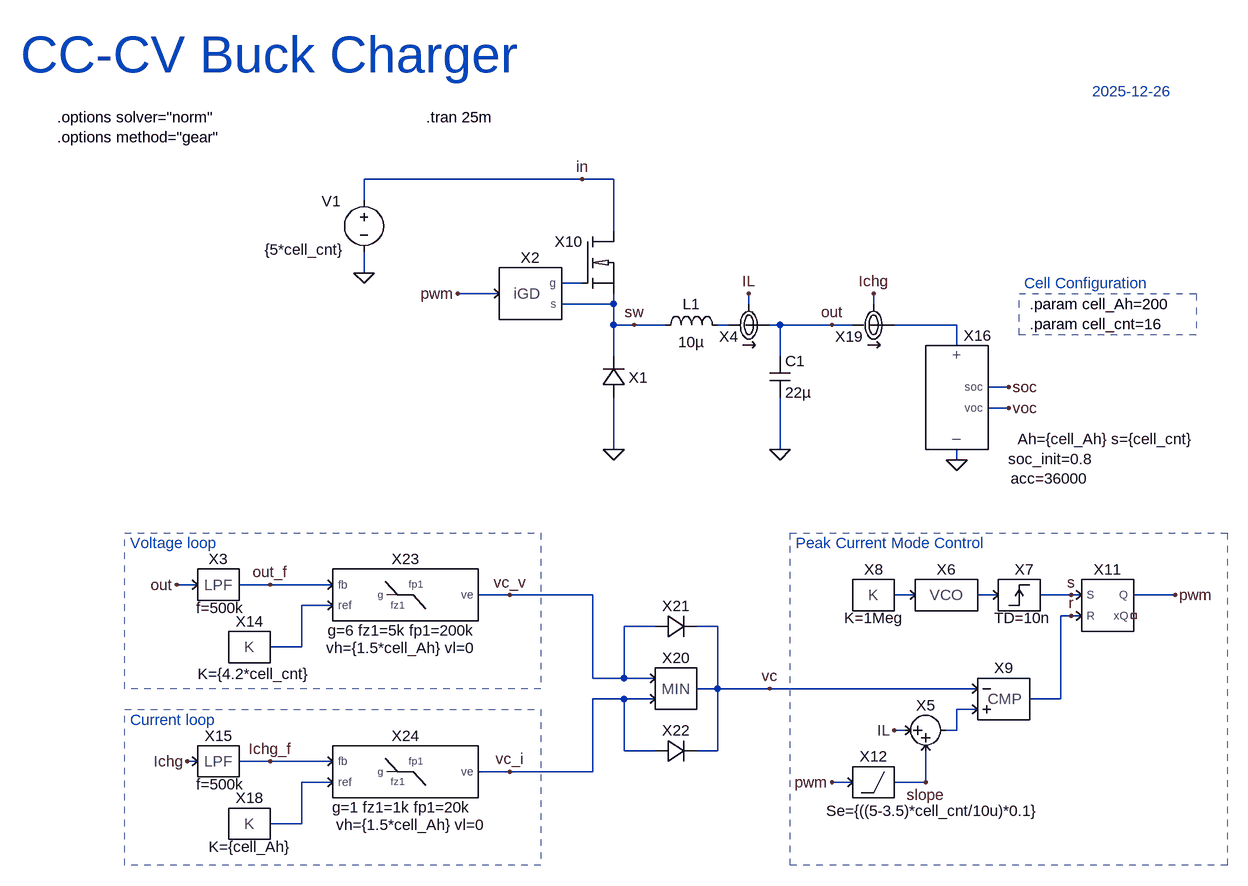
[diagram p0: schematic BUCK_CCCV.asc]
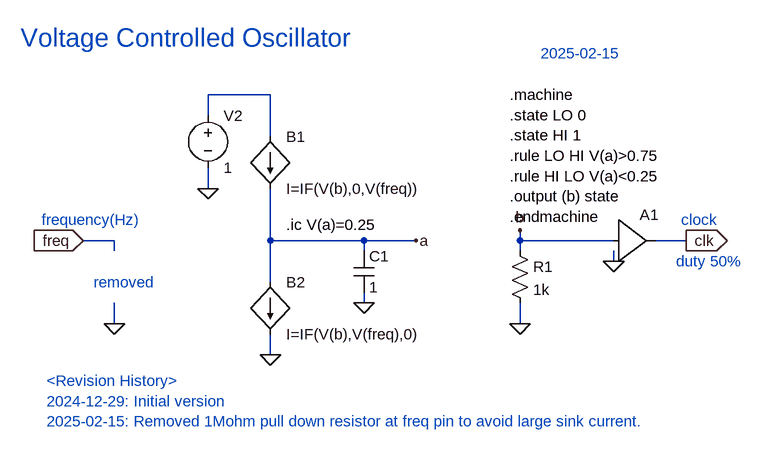
[diagram p1: sub-circuit vco.asc]
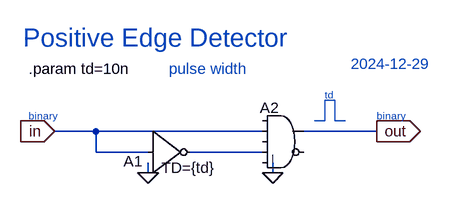
[diagram p2: sub-circuit posedge.asc]
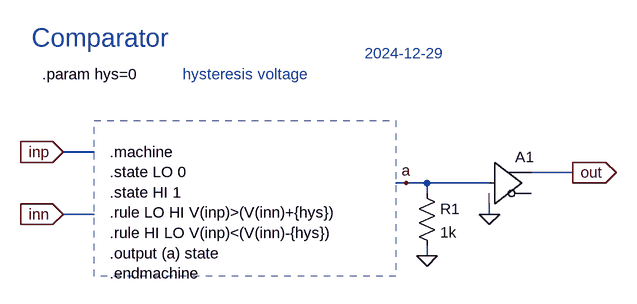
[diagram p3: sub-circuit cmp.asc]
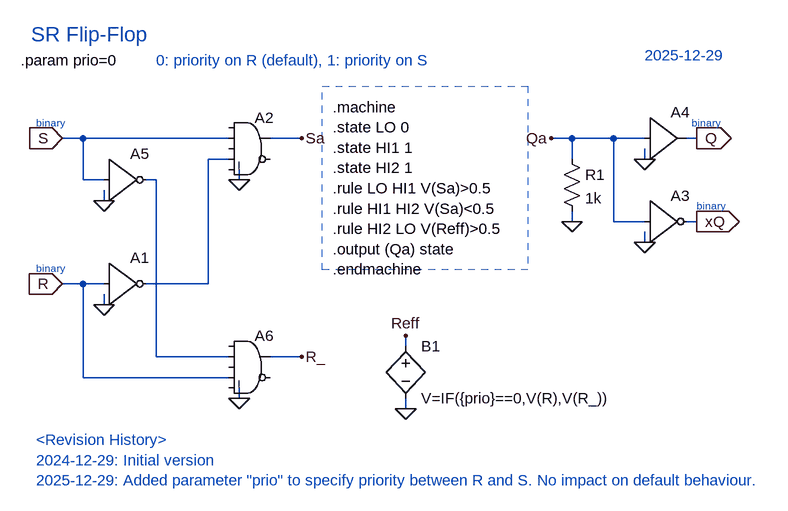
[diagram p4: sub-circuit srff.asc]
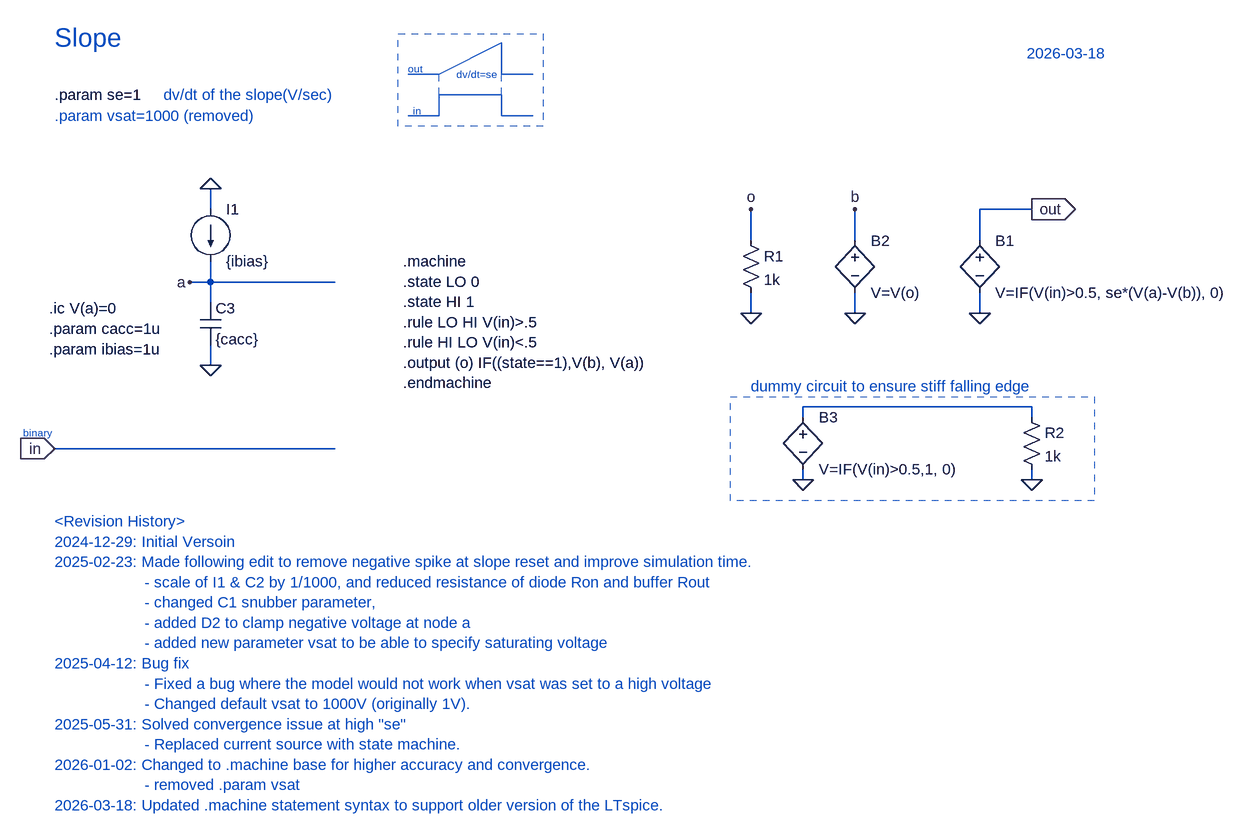
[diagram p5: sub-circuit slope.asc]
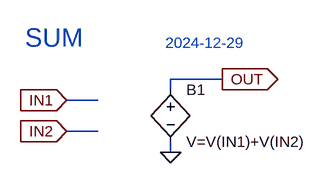
[diagram p6: sub-circuit sum.asc]
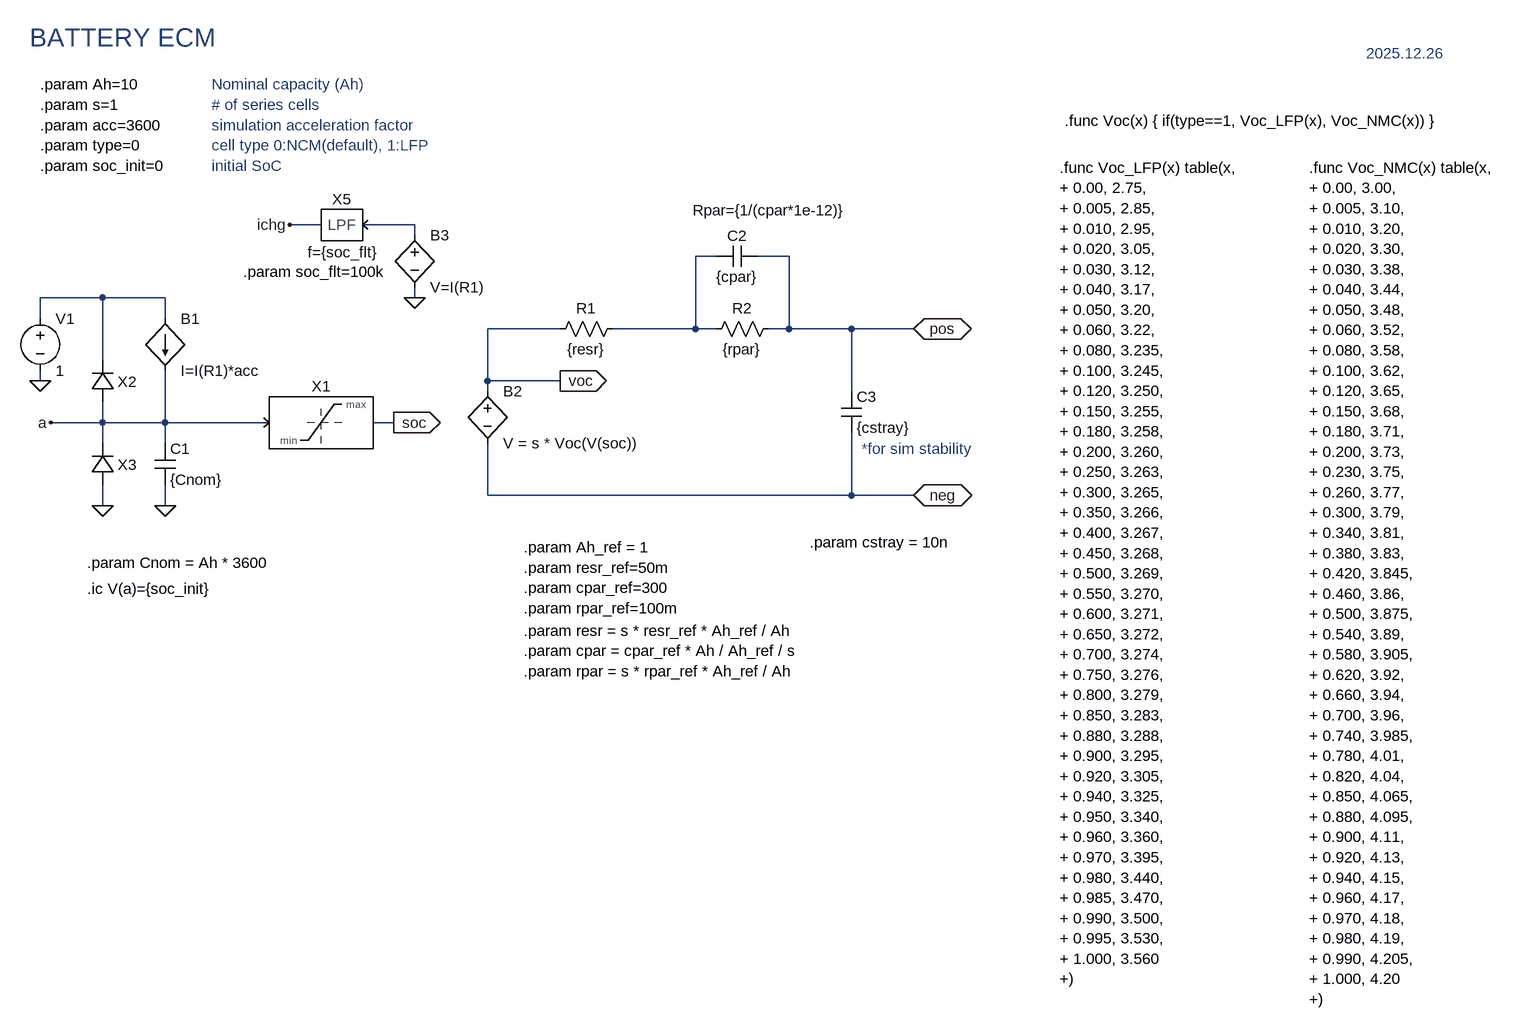
[diagram p7: sub-circuit battery_ecm.asc]
BUCK_CCCV.asc, the LTspice schematic file:
Version 4.1
SHEET 1 1764 1444
WIRE 560 256 224 256
WIRE 608 256 560 256
WIRE 224 288 224 256
WIRE 608 336 608 256
WIRE 224 400 224 368
WIRE 560 416 528 416
WIRE 432 432 368 432
WIRE 608 448 608 432
WIRE 608 448 528 448
WIRE 816 448 816 432
WIRE 1008 448 1008 432
WIRE 608 480 608 448
WIRE 640 480 608 480
WIRE 688 480 640 480
WIRE 784 480 768 480
WIRE 864 480 848 480
WIRE 944 480 864 480
WIRE 976 480 944 480
WIRE 1136 480 1040 480
WIRE 1136 512 1136 480
WIRE 608 528 608 480
WIRE 864 528 864 480
WIRE 1216 576 1184 576
WIRE 1216 608 1184 608
WIRE 608 672 608 592
WIRE 864 672 864 592
WIRE 1136 688 1136 672
WIRE -32 880 -64 880
WIRE 80 880 32 880
WIRE 176 880 80 880
WIRE 448 896 400 896
WIRE 576 896 448 896
WIRE 1072 896 1040 896
WIRE 1200 896 1168 896
WIRE 1312 896 1264 896
WIRE 1328 896 1312 896
WIRE 1472 896 1408 896
WIRE 176 912 128 912
WIRE 1312 928 1296 928
WIRE 1328 928 1312 928
WIRE 672 944 624 944
WIRE 768 944 736 944
WIRE 128 976 128 912
WIRE 128 976 80 976
WIRE 576 1024 576 896
WIRE 624 1024 624 944
WIRE 624 1024 576 1024
WIRE 672 1024 624 1024
WIRE 768 1040 768 944
WIRE 768 1040 736 1040
WIRE 848 1040 768 1040
WIRE 1168 1040 848 1040
WIRE 624 1056 576 1056
WIRE 672 1056 624 1056
WIRE 1296 1056 1296 928
WIRE 1296 1056 1248 1056
WIRE 1168 1072 1136 1072
WIRE 1056 1104 1040 1104
WIRE 1136 1104 1136 1072
WIRE 1136 1104 1120 1104
WIRE 624 1136 624 1056
WIRE 672 1136 624 1136
WIRE 768 1136 768 1040
WIRE 768 1136 736 1136
WIRE -32 1152 -48 1152
WIRE 80 1152 32 1152
WIRE 176 1152 80 1152
WIRE 448 1168 400 1168
WIRE 576 1168 576 1056
WIRE 576 1168 448 1168
WIRE 176 1184 128 1184
WIRE 976 1184 944 1184
WIRE 1088 1184 1088 1136
WIRE 1088 1184 1040 1184
WIRE 128 1248 128 1184
WIRE 128 1248 80 1248
FLAG 608 672 0
FLAG 224 400 0
FLAG 864 672 0
FLAG 944 480 out
FLAG 560 256 in
FLAG 640 480 sw
FLAG 448 896 vc_v
FLAG 1472 896 pwm
FLAG 816 432 IL
FLAG 1040 1104 IL
FLAG 1312 896 s
FLAG 1312 928 r
FLAG 944 1184 pwm
FLAG 1088 1184 slope
FLAG -64 880 out
FLAG 1136 688 0
FLAG 1216 576 soc
FLAG 1216 608 voc
FLAG 448 1168 vc_i
FLAG -48 1152 Ichg
FLAG 1008 432 Ichg
FLAG 80 880 out_f
FLAG 80 1152 Ichg_f
FLAG 848 1040 vc
FLAG 368 432 pwm
SYMBOL voltage 224 272 R0
WINDOW 0 -50 2 Top 2
WINDOW 3 -92 108 Bottom 2
WINDOW 123 0 0 Left 0
WINDOW 39 0 0 Left 0
SYMATTR InstName V1
SYMATTR Value {5*cell_cnt}
SYMBOL ind 672 496 R270
WINDOW 0 32 56 VTop 2
WINDOW 3 5 56 VBottom 2
SYMATTR InstName L1
SYMATTR Value 10µ
SYMATTR SpiceLine Rser=1m
SYMBOL cap 848 528 R0
SYMATTR InstName C1
SYMATTR Value 22µ
SYMATTR SpiceLine Rser=1m
SYMBOL iGD 480 432 R0
SYMATTR InstName X2
SYMBOL IMON 816 480 M180
SYMATTR InstName X4
SYMBOL VCO 1120 896 R0
SYMATTR InstName X6
SYMBOL POSEDGE 1232 896 R0
WINDOW 39 5 51 Bottom 2
SYMATTR SpiceLine TD=10n
SYMATTR InstName X7
SYMBOL CONST 1008 896 R0
WINDOW 39 0 51 Bottom 2
SYMATTR SpiceLine K=1Meg
SYMATTR InstName X8
SYMBOL CMP 1216 1056 R0
SYMATTR InstName X9
SYMBOL SRFF 1360 912 R0
SYMATTR InstName X11
SYMBOL SLOPE 1008 1184 R0
WINDOW 39 92 60 Bottom 2
SYMATTR SpiceLine Se={((5-3.5)*cell_cnt/10u)*0.1}
SYMATTR InstName X12
SYMBOL CONST 48 976 R0
WINDOW 39 6 57 Bottom 2
SYMATTR SpiceLine K={4.2*cell_cnt}
SYMATTR InstName X14
SYMBOL SUM 1088 1104 R0
SYMATTR InstName X5
SYMBOL iNMOS 608 384 R0
SYMATTR InstName X10
SYMBOL PowerSim\\BATTERY_ECM 1136 592 R0
WINDOW 3 229 79 Bottom 2
WINDOW 123 144 110 Bottom 2
WINDOW 40 143 140 Bottom 2
SYMATTR Value Ah={cell_Ah} s={cell_cnt}
SYMATTR Value2 soc_init=0.8
SYMATTR SpiceLine2 acc=36000
SYMATTR InstName X16
SYMBOL CONST 48 1248 R0
WINDOW 39 0 51 Bottom 2
SYMATTR SpiceLine K={cell_Ah}
SYMATTR InstName X18
SYMBOL IMON 1008 480 M180
SYMATTR InstName X19
SYMBOL PowerSim\\MIN 704 1040 R0
SYMATTR InstName X20
SYMBOL iD 608 560 R180
SYMATTR InstName X1
SYMBOL PowerSim\\LPF 0 880 R0
WINDOW 3 3 51 Bottom 2
SYMATTR Value f=500k
SYMATTR InstName X3
SYMBOL PowerSim\\LPF 0 1152 R0
WINDOW 3 3 51 Bottom 2
SYMATTR Value f=500k
SYMATTR InstName X15
SYMBOL iD 704 944 R270
WINDOW 0 16 0 VTop 2
SYMATTR InstName X21
SYMBOL iD 704 1136 R270
WINDOW 0 16 0 VTop 2
SYMATTR InstName X22
SYMBOL PowerSim\\TYPE2_gm 288 896 R0
WINDOW 39 -6 70 Bottom 2
WINDOW 40 -7 97 Bottom 2
SYMATTR SpiceLine g=6 fz1=5k fp1=200k
SYMATTR SpiceLine2 vh={1.5*cell_Ah} vl=0
SYMATTR InstName X23
SYMBOL PowerSim\\TYPE2_gm 288 1168 R0
WINDOW 39 -6 70 Bottom 2
WINDOW 40 8 97 Bottom 2
SYMATTR SpiceLine g=1 fz1=1k fp1=20k
SYMATTR SpiceLine2 vh={1.5*cell_Ah} vl=0
SYMATTR InstName X24
TEXT 320 160 Left 2 !.tran 25m
TEXT -304 64 Left 6 ;CC-CV Buck Charger
TEXT 1344 120 Left 2 ;2025-12-26
TEXT -248 160 Left 2 !.options solver="norm"\n.options method="gear"
TEXT -136 816 Left 2 ;Voltage loop
TEXT -136 1088 Left 2 ;Current loop
TEXT 888 816 Left 2 ;Peak Current Mode Control
TEXT 1248 448 Left 2 !.param cell_Ah=200\n.param cell_cnt=16
TEXT 1240 416 Left 2 ;Cell Configuration
RECTANGLE Normal 496 1040 -144 800 2
RECTANGLE Normal 496 1312 -144 1072 2
RECTANGLE Normal 1552 1312 880 800 2
RECTANGLE Normal 1504 496 1232 432 2

vco.asc, the sub-circuit schematic file:
Version 4
SHEET 1 1132 680
WIRE 176 -176 80 -176
WIRE 80 -144 80 -176
WIRE 176 -112 176 -176
WIRE 80 -32 80 -64
WIRE -64 48 -112 48
WIRE 176 48 176 -32
WIRE 320 48 176 48
WIRE 400 48 320 48
WIRE 560 48 560 32
WIRE 704 48 560 48
WIRE 816 48 768 48
WIRE -64 64 -64 48
WIRE 320 64 320 48
WIRE 560 64 560 48
WIRE 704 80 704 64
WIRE 176 112 176 48
WIRE 320 144 320 128
WIRE -64 176 -64 144
WIRE 560 176 560 144
WIRE 176 224 176 192
FLAG 320 144 0
FLAG 560 176 0
FLAG 176 224 0
FLAG 80 -32 0
FLAG 400 48 a
FLAG 560 32 b
FLAG 704 80 0
FLAG 816 48 clk
IOPIN 816 48 Out
FLAG -112 48 freq
IOPIN -112 48 In
FLAG -64 176 0
SYMBOL cap 304 64 R0
SYMATTR InstName C1
SYMATTR Value 1
SYMBOL res 544 48 R0
SYMATTR InstName R1
SYMATTR Value 1k
SYMBOL voltage 80 -160 R0
WINDOW 123 0 0 Left 0
WINDOW 39 0 0 Left 0
SYMATTR InstName V2
SYMATTR Value 1
SYMBOL bi 176 112 R0
SYMATTR InstName B2
SYMATTR Value I=IF(V(b),V(freq),0)
SYMBOL bi 176 -112 R0
SYMATTR InstName B1
SYMATTR Value I=IF(V(b),0,V(freq))
SYMBOL Digital\\buf1 704 -16 R0
SYMATTR InstName A1
TEXT 544 -176 Left 2 !.machine\n.state LO 0\n.state HI 1\n.rule LO HI V(a)>0.75\n.rule HI LO V(a)<0.25\n.output (b) state\n.endmachine
TEXT 200 24 Left 2 !.ic V(a)=0.25
TEXT -208 -264 Left 4 ;Voltage Controlled Oscillator
TEXT -176 16 Left 2 ;frequency(Hz)
TEXT 808 16 Left 2 ;clock
TEXT 800 80 Left 2 ;duty 50%
TEXT 592 -240 Left 2 ;2025-02-15
TEXT -168 264 Left 2 ;<Revision History>\n2024-12-29: Initial version\n2025-02-15: Removed 1Mohm pull down resistor at freq pin to avoid large sink current.
TEXT -96 112 Left 2 ;removed

posedge.asc, the sub-circuit schematic file:
Version 4
SHEET 1 880 680
WIRE 192 160 128 160
WIRE 448 160 192 160
WIRE 624 160 512 160
WIRE 192 192 192 160
WIRE 272 192 192 192
WIRE 448 192 336 192
WIRE 272 224 272 208
WIRE 464 224 464 208
FLAG 128 160 in
IOPIN 128 160 In
FLAG 464 224 0
FLAG 624 160 out
IOPIN 624 160 Out
FLAG 272 224 0
SYMBOL Digital\\and 480 112 R0
WINDOW 0 -36 12 Left 2
SYMATTR InstName A2
SYMBOL Digital\\inv 272 128 R0
WINDOW 3 21 88 Left 2
WINDOW 0 -38 78 Left 2
SYMATTR Value TD={td}
SYMATTR InstName A1
TEXT 88 64 Left 2 !.param td=10n
TEXT 80 16 Left 4 ;Positive Edge Detector
TEXT 88 136 Left 1 ;binary
TEXT 624 136 Left 1 ;binary
TEXT 544 104 Left 1 ;td
TEXT 304 64 Left 2 ;pulse width
TEXT 584 56 Left 2 ;2024-12-29
LINE Normal 544 144 528 144
LINE Normal 544 144 544 112
LINE Normal 560 144 560 112
LINE Normal 576 144 560 144
LINE Normal 544 112 560 112

cmp.asc, the sub-circuit schematic file:
Version 4
SHEET 1 1276 680
WIRE 352 96 304 96
WIRE 1088 128 1024 128
WIRE 832 144 816 144
WIRE 864 144 832 144
WIRE 960 144 864 144
WIRE 864 160 864 144
WIRE 352 192 304 192
WIRE 960 192 960 176
WIRE 864 256 864 240
FLAG 304 96 inp
IOPIN 304 96 In
FLAG 304 192 inn
IOPIN 304 192 In
FLAG 1088 128 out
IOPIN 1088 128 Out
FLAG 864 256 0
FLAG 832 144 a
FLAG 960 192 0
SYMBOL res 848 144 R0
SYMATTR InstName R1
SYMATTR Value 1k
SYMBOL Digital\\buf 960 80 R0
SYMATTR InstName A1
TEXT 376 96 Left 2 !.machine\n.state LO 0\n.state HI 1\n.rule LO HI V(inp)>(V(inn)+{hys})\n.rule HI LO V(inp)<(V(inn)-{hys})\n.output (a) state\n.endmachine
TEXT 272 -24 Left 2 !.param hys=0
TEXT 256 -80 Left 4 ;Comparator
TEXT 488 -24 Left 2 ;hysteresis voltage
TEXT 768 -56 Left 2 ;2024-12-29
RECTANGLE Normal 816 288 352 48 2

srff.asc, the sub-circuit schematic file:
Version 4.1
SHEET 1 928 680
WIRE -272 -496 -304 -496
WIRE -48 -496 -272 -496
WIRE 64 -496 16 -496
WIRE 480 -496 448 -496
WIRE 544 -496 480 -496
WIRE 592 -496 544 -496
WIRE 672 -496 656 -496
WIRE -48 -464 -80 -464
WIRE 480 -464 480 -496
WIRE 592 -464 592 -480
WIRE -272 -432 -272 -496
WIRE -240 -432 -272 -432
WIRE -160 -432 -176 -432
WIRE -32 -432 -32 -448
WIRE -240 -400 -240 -416
WIRE 480 -368 480 -384
WIRE 544 -368 544 -496
WIRE 592 -368 544 -368
WIRE 672 -368 656 -368
WIRE 592 -336 592 -352
WIRE -272 -272 -304 -272
WIRE -240 -272 -272 -272
WIRE -80 -272 -80 -464
WIRE -80 -272 -176 -272
WIRE -240 -240 -240 -256
WIRE 224 -176 224 -192
WIRE -160 -160 -160 -432
WIRE -48 -160 -160 -160
WIRE 64 -160 16 -160
WIRE -272 -128 -272 -272
WIRE -48 -128 -272 -128
WIRE -32 -96 -32 -112
WIRE 224 -80 224 -96
FLAG -304 -496 S
IOPIN -304 -496 In
FLAG -304 -272 R
IOPIN -304 -272 In
FLAG -240 -240 0
FLAG -32 -432 0
FLAG 64 -496 Sa
FLAG 592 -336 0
FLAG 672 -496 Q
IOPIN 672 -496 Out
FLAG 672 -368 xQ
IOPIN 672 -368 Out
FLAG 592 -464 0
FLAG 448 -496 Qa
FLAG 480 -368 0
FLAG 224 -80 0
FLAG 224 -192 Reff
FLAG -240 -400 0
FLAG -32 -96 0
FLAG 64 -160 R_
SYMBOL Digital\\inv -240 -336 R0
SYMATTR InstName A1
SYMBOL Digital\\and -16 -544 R0
SYMATTR InstName A2
SYMBOL Digital\\inv 592 -432 R0
SYMATTR InstName A3
SYMBOL Digital\\buf1 592 -560 R0
SYMATTR InstName A4
SYMBOL res 464 -480 R0
SYMATTR InstName R1
SYMATTR Value 1k
SYMBOL bv 224 -192 R0
SYMATTR InstName B1
SYMATTR Value V=IF({prio}==0,V(R),V(R_))
SYMBOL Digital\\inv -240 -496 R0
SYMATTR InstName A5
SYMBOL Digital\\and -16 -208 R0
SYMATTR InstName A6
TEXT 112 -544 Left 2 !.machine\n.state LO 0\n.state HI1 1\n.state HI2 1\n.rule LO HI1 V(Sa)>0.5\n.rule HI1 HI2 V(Sa)<0.5\n.rule HI2 LO V(Reff)>0.5\n.output (Qa) state\n.endmachine
TEXT -352 -656 Left 3 ;SR Flip-Flop
TEXT -344 -520 Left 1 ;binary
TEXT -344 -296 Left 1 ;binary
TEXT 664 -520 Left 1 ;binary
TEXT 672 -392 Left 1 ;binary
TEXT 592 -624 Left 2 ;2025-12-29
TEXT -368 -616 Left 2 !.param prio=0
TEXT -160 -616 Left 2 ;0: priority on R (default), 1: priority on S
TEXT -344 -32 Left 2 ;<Revision History>\n2024-12-29: Initial version\n2025-12-29: Added parameter "prio" to specify priority between R and S. No impact on default behaviour.
RECTANGLE Normal 412 -294 96 -576 2

slope.asc, the sub-circuit schematic file:
Version 4.1
SHEET 1 2080 1228
WIRE -64 288 -64 256
WIRE 1200 288 1120 288
WIRE 768 336 768 288
WIRE 928 336 928 288
WIRE 1120 336 1120 288
WIRE -64 400 -64 368
WIRE -64 400 -96 400
WIRE 128 400 -64 400
WIRE -64 432 -64 400
WIRE 768 448 768 416
WIRE 928 448 928 416
WIRE 1120 448 1120 416
WIRE -64 528 -64 496
WIRE 1200 592 848 592
WIRE 848 608 848 592
WIRE 1200 608 1200 592
WIRE 128 656 -304 656
WIRE 848 704 848 688
WIRE 1200 704 1200 688
FLAG -304 656 in
IOPIN -304 656 In
FLAG -64 256 0
FLAG -64 528 0
FLAG 1200 288 out
IOPIN 1200 288 Out
FLAG -96 400 a
FLAG 1120 448 0
FLAG 768 448 0
FLAG 768 288 o
FLAG 928 448 0
FLAG 928 288 b
FLAG 1200 704 0
FLAG 848 704 0
SYMBOL current -64 288 R0
SYMATTR InstName I1
SYMATTR Value {ibias}
SYMBOL cap -80 432 R0
SYMATTR InstName C3
SYMATTR Value {cacc}
SYMBOL bv 1120 320 R0
SYMATTR InstName B1
SYMATTR Value V=IF(V(in)>0.5, se*(V(a)-V(b)), 0)
SYMBOL res 752 320 R0
SYMATTR InstName R1
SYMATTR Value 1k
SYMBOL bv 928 320 R0
SYMATTR InstName B2
SYMATTR Value V=V(o)
SYMBOL bv 848 592 R0
SYMATTR InstName B3
SYMATTR Value V=IF(V(in)>0.5,1, 0)
SYMBOL res 1184 592 R0
SYMATTR InstName R2
SYMATTR Value 1k
TEXT -304 112 Left 2 !.param se=1
TEXT -304 24 Left 4 ;Slope
TEXT -352 632 Left 1 ;binary
TEXT -136 112 Left 2 ;dv/dt of the slope(V/sec)
TEXT 248 136 Left 1 ;in
TEXT 240 72 Left 1 ;out
TEXT 376 80 Right 1 ;dv/dt=se
TEXT 1192 48 Left 2 ;2026-03-18
TEXT -304 768 Left 2 ;<Revision History>\n2024-12-29: Initial Versoin\n2025-02-23: Made following edit to remove negative spike at slope reset and improve simulation time.\n                    - scale of I1 & C2 by 1/1000, and reduced resistance of diode Ron and buffer Rout\n                    - changed C1 snubber parameter, \n                    - added D2 to clamp negative voltage at node a \n                    - added new parameter vsat to be able to specify saturating voltage\n2025-04-12: Bug fix \n                    - Fixed a bug where the model would not work when vsat was set to a high voltage \n                    - Changed default vsat to 1000V (originally 1V).\n2025-05-31: Solved convergence issue at high "se" \n                    - Replaced current source with state machine.\n2026-01-02: Changed to .machine base for higher accuracy and convergence.\n                    - removed .param vsat\n2026-03-18: Updated .machine statement syntax to support older version of the LTspice.
TEXT -304 144 Left 2 ;.param vsat=1000 (removed)
TEXT -312 472 Left 2 !.param cacc=1u\n.param ibias=1u
TEXT -312 440 Left 2 !.ic V(a)=0
TEXT 232 368 Left 2 !.machine\n.state LO 0\n.state HI 1\n.rule LO HI V(in)>.5\n.rule HI LO V(in)<.5\n.output (o) IF((state==1),V(b), V(a))\n.endmachine
TEXT 768 560 Left 2 ;dummy circuit to ensure stiff falling edge
LINE Normal 288 144 240 144
LINE Normal 288 144 288 112
LINE Normal 384 112 288 112
LINE Normal 384 144 384 112
LINE Normal 432 144 384 144
LINE Normal 288 80 240 80
LINE Normal 288 80 384 32
LINE Normal 384 80 384 32
LINE Normal 432 80 384 80
LINE Normal 288 112 288 80 1
LINE Normal 384 112 384 80 1
RECTANGLE Normal 448 160 225 18 2
RECTANGLE Normal 1296 736 736 576 2

sum.asc, the sub-circuit schematic file:
Version 4
SHEET 1 880 680
WIRE 288 96 208 96
WIRE 208 112 208 96
WIRE 96 128 48 128
WIRE 96 176 48 176
WIRE 208 208 208 192
FLAG 48 128 IN1
IOPIN 48 128 In
FLAG 48 176 IN2
IOPIN 48 176 In
FLAG 208 208 0
FLAG 288 96 OUT
IOPIN 288 96 Out
SYMBOL bv 208 96 R0
SYMATTR InstName B1
SYMATTR Value V=V(IN1)+V(IN2)
TEXT -16 32 Left 4 ;SUM
TEXT 200 40 Left 2 ;2024-12-29

battery_ecm.asc, the sub-circuit schematic file:
Version 4.1
SHEET 1 1876 1176
WIRE 48 -176 0 -176
WIRE 192 -176 112 -176
WIRE 192 -160 192 -176
WIRE 656 -128 624 -128
WIRE 768 -128 720 -128
WIRE -288 -64 -384 -64
WIRE -192 -64 -288 -64
WIRE 192 -64 192 -80
WIRE -384 -32 -384 -64
WIRE -192 -32 -192 -64
WIRE 416 -16 304 -16
WIRE 624 -16 624 -128
WIRE 624 -16 496 -16
WIRE 656 -16 624 -16
WIRE 768 -16 768 -128
WIRE 768 -16 736 -16
WIRE 864 -16 768 -16
WIRE 960 -16 864 -16
WIRE -288 32 -288 -64
WIRE -384 64 -384 48
WIRE 304 64 304 -16
WIRE 416 64 304 64
WIRE 304 80 304 64
WIRE 864 80 864 -16
WIRE -288 128 -288 96
WIRE -288 128 -368 128
WIRE -192 128 -192 48
WIRE -192 128 -288 128
WIRE -32 128 -192 128
WIRE 160 128 128 128
WIRE -288 160 -288 128
WIRE -192 160 -192 128
WIRE 304 240 304 160
WIRE 864 240 864 144
WIRE 864 240 304 240
WIRE 960 240 864 240
WIRE -288 256 -288 224
WIRE -192 256 -192 224
FLAG -192 256 0
FLAG 160 128 soc
IOPIN 160 128 Out
FLAG -384 64 0
FLAG 416 64 voc
IOPIN 416 64 Out
FLAG 960 240 neg
IOPIN 960 240 BiDir
FLAG 960 -16 pos
IOPIN 960 -16 BiDir
FLAG -368 128 a
FLAG -288 256 0
FLAG 0 -176 ichg
FLAG 192 -64 0
SYMBOL cap -208 160 R0
SYMATTR InstName C1
SYMATTR Value {Cnom}
SYMATTR SpiceLine Rpar=10000Gig
SYMBOL bi -192 -32 R0
SYMATTR InstName B1
SYMATTR Value I=I(R1)*acc
SYMBOL voltage -384 -48 R0
WINDOW 123 0 0 Left 0
WINDOW 39 0 0 Left 0
SYMATTR InstName V1
SYMATTR Value 1
SYMBOL bv 304 64 R0
SYMATTR InstName B2
SYMATTR Value V = s * Voc(V(soc))
SYMBOL res 512 -32 R90
WINDOW 0 0 56 VBottom 2
WINDOW 3 32 56 VTop 2
SYMATTR InstName R1
SYMATTR Value {resr}
SYMBOL res 752 -32 R90
WINDOW 0 0 56 VBottom 2
WINDOW 3 32 56 VTop 2
SYMATTR InstName R2
SYMATTR Value {rpar}
SYMBOL cap 720 -144 R90
WINDOW 0 0 32 VBottom 2
WINDOW 3 32 32 VTop 2
WINDOW 39 -39 -19 VBottom 2
SYMATTR InstName C2
SYMATTR Value {cpar}
SYMATTR SpiceLine Rpar={1/(cpar*1e-12)}
SYMBOL PowerSim\\LIMIT 48 128 R0
SYMATTR InstName X1
SYMBOL iD -288 64 R180
SYMATTR InstName X2
SYMATTR Value von=1n ron=1n
SYMBOL iD -288 192 R180
SYMATTR InstName X3
SYMATTR Value von=1n ron=1n
SYMBOL PowerSim\\LPF 80 -176 M0
WINDOW 3 -1 58 Bottom 2
SYMATTR Value f={soc_flt}
SYMATTR InstName X5
SYMBOL bv 192 -176 R0
SYMATTR InstName B3
SYMATTR Value V=I(R1)
SYMBOL cap 848 80 R0
SYMATTR InstName C3
SYMATTR Value {cstray}
TEXT 1184 -264 Left 2 !.func Voc_LFP(x) table(x,\n+ 0.00, 2.75,\n+ 0.005, 2.85,\n+ 0.010, 2.95,\n+ 0.020, 3.05,\n+ 0.030, 3.12,\n+ 0.040, 3.17,\n+ 0.050, 3.20,\n+ 0.060, 3.22,\n+ 0.080, 3.235,\n+ 0.100, 3.245,\n+ 0.120, 3.250,\n+ 0.150, 3.255,\n+ 0.180, 3.258,\n+ 0.200, 3.260,\n+ 0.250, 3.263,\n+ 0.300, 3.265,\n+ 0.350, 3.266,\n+ 0.400, 3.267,\n+ 0.450, 3.268,\n+ 0.500, 3.269,\n+ 0.550, 3.270,\n+ 0.600, 3.271,\n+ 0.650, 3.272,\n+ 0.700, 3.274,\n+ 0.750, 3.276,\n+ 0.800, 3.279,\n+ 0.850, 3.283,\n+ 0.880, 3.288,\n+ 0.900, 3.295,\n+ 0.920, 3.305,\n+ 0.940, 3.325,\n+ 0.950, 3.340,\n+ 0.960, 3.360,\n+ 0.970, 3.395,\n+ 0.980, 3.440,\n+ 0.985, 3.470,\n+ 0.990, 3.500,\n+ 0.995, 3.530,\n+ 1.000, 3.560\n+)
TEXT -384 -392 Left 2 !.param Ah=10\n.param s=1\n.param acc=3600\n.param type=0\n.param soc_init=0
TEXT -120 -392 Left 2 ;Nominal capacity (Ah)\n# of series cells\nsimulation acceleration factor\ncell type 0:NCM(default), 1:LFP\ninitial SoC
TEXT 360 320 Left 2 !.param Ah_ref = 1\n.param resr_ref=50m\n.param cpar_ref=300\n.param rpar_ref=100m
TEXT 360 448 Left 2 !.param resr = s * resr_ref * Ah_ref / Ah\n.param cpar = cpar_ref * Ah / Ah_ref / s\n.param rpar = s * rpar_ref * Ah_ref / Ah
TEXT -312 344 Left 2 !.param Cnom = Ah * 3600
TEXT 1192 -336 Left 2 !.func Voc(x) { if(type==1, Voc_LFP(x), Voc_NMC(x)) }
TEXT 1568 -264 Left 2 !.func Voc_NMC(x) table(x,\n+ 0.00, 3.00,\n+ 0.005, 3.10,\n+ 0.010, 3.20,\n+ 0.020, 3.30,\n+ 0.030, 3.38,\n+ 0.040, 3.44,\n+ 0.050, 3.48,\n+ 0.060, 3.52,\n+ 0.080, 3.58,\n+ 0.100, 3.62,\n+ 0.120, 3.65,\n+ 0.150, 3.68,\n+ 0.180, 3.71,\n+ 0.200, 3.73,\n+ 0.230, 3.75,\n+ 0.260, 3.77,\n+ 0.300, 3.79,\n+ 0.340, 3.81,\n+ 0.380, 3.83,\n+ 0.420, 3.845,\n+ 0.460, 3.86,\n+ 0.500, 3.875,\n+ 0.540, 3.89,\n+ 0.580, 3.905,\n+ 0.620, 3.92,\n+ 0.660, 3.94,\n+ 0.700, 3.96,\n+ 0.740, 3.985,\n+ 0.780, 4.01,\n+ 0.820, 4.04,\n+ 0.850, 4.065,\n+ 0.880, 4.095,\n+ 0.900, 4.11,\n+ 0.920, 4.13,\n+ 0.940, 4.15,\n+ 0.960, 4.17,\n+ 0.970, 4.18,\n+ 0.980, 4.19,\n+ 0.990, 4.205,\n+ 1.000, 4.20\n+)
TEXT -312 384 Left 2 !.ic V(a)={soc_init}
TEXT -400 -464 Left 4 ;BATTERY ECM
TEXT 1656 -440 Left 2 ;2025.12.26
TEXT -72 -104 Left 2 !.param soc_flt=100k
TEXT 800 312 Left 2 !.param cstray = 10n
TEXT 880 168 Left 2 ;*for sim stability

lpf.asc, the sub-circuit schematic file:
Version 4.1
SHEET 1 1652 804
WIRE 944 -80 848 -80
WIRE 192 -48 80 -48
WIRE 304 -48 272 -48
WIRE 384 -48 304 -48
WIRE 688 -48 464 -48
WIRE 80 -32 80 -48
WIRE 304 -32 304 -48
WIRE 464 -32 464 -48
WIRE 848 -16 848 -80
WIRE -96 0 -160 0
WIRE 304 48 304 32
WIRE 464 64 464 48
WIRE 80 80 80 48
WIRE 848 112 848 64
WIRE 192 288 192 256
WIRE 192 288 128 288
WIRE 256 288 192 288
WIRE 496 288 496 256
WIRE 496 288 432 288
WIRE 560 288 496 288
WIRE 192 320 192 288
WIRE 256 320 256 288
WIRE 432 320 432 288
WIRE 496 320 496 288
WIRE 560 320 560 288
WIRE 128 336 128 288
WIRE 128 480 128 416
WIRE 192 480 192 384
WIRE 256 480 256 400
WIRE 432 480 432 400
WIRE 496 480 496 384
WIRE 560 480 560 400
FLAG -160 0 in
IOPIN -160 0 In
FLAG 944 -80 out
IOPIN 944 -80 Out
FLAG 304 48 0
FLAG 80 80 0
FLAG 384 -48 a
FLAG 464 64 0
FLAG 848 112 0
FLAG 256 480 0
FLAG 192 256 v1
FLAG 496 256 v2
FLAG 128 480 0
FLAG 560 480 0
FLAG 688 -48 v0
FLAG 192 480 0
FLAG 496 480 0
FLAG 432 480 0
SYMBOL res 288 -64 R90
WINDOW 0 0 56 VBottom 2
WINDOW 3 32 56 VTop 2
SYMATTR InstName R1
SYMATTR Value 1k
SYMBOL cap 288 -32 R0
SYMATTR InstName C1
SYMATTR Value {Co}
SYMBOL bv 80 -48 R0
SYMATTR InstName B1
SYMATTR Value V=V(in)
SYMBOL bv 464 -48 R0
SYMATTR InstName B2
SYMATTR Value V=V(a)
SYMBOL bv 848 -32 R0
SYMATTR InstName B3
SYMATTR Value V=IF({n}==1,V(v0),V(v1))
SYMBOL res 240 304 R0
SYMATTR InstName R2
SYMATTR Value 1Gig
SYMBOL cap 176 320 R0
SYMATTR InstName C2
SYMATTR Value 1
SYMBOL bi 128 416 R180
WINDOW 0 24 80 Left 2
WINDOW 3 24 0 Left 2
SYMATTR InstName B5
SYMATTR Value I=V(v2)
SYMBOL res 448 304 M0
SYMATTR InstName R3
SYMATTR Value 1Gig
SYMBOL cap 512 320 M0
SYMATTR InstName C3
SYMATTR Value 1
SYMBOL bi 560 400 R180
WINDOW 3 -848 -5 Left 2
WINDOW 0 -56 82 Left 2
SYMATTR Value I={-(2*pi*f)*(2*pi*f)*V(v1)-(2*pi*f/q)*V(v2)+(2*pi*f)*(2*pi*f)*V(in)}
SYMATTR InstName B4
TEXT -264 -368 Left 4 ;1st/2nd order Low Pass Filter
TEXT 696 -368 Left 2 ;2025-12-26
TEXT -256 -304 Left 2 !.param f=100k\n.param n=1\n.param q=0.5
TEXT 328 -80 Left 2 !.param Co=1/({f}*2k*PI)
TEXT 0 -304 Left 2 ;cut off frequency\nfilter order (1:1st order, other: 2nd order)\nq factor (only for 2nd order)
TEXT -8 -112 Left 2 ;1st Order LPF
TEXT 8 160 Left 2 ;2nd Order LPF
TEXT -152 560 Left 2 ;<Revision History>\n2025-03-23: Initial version\n2025-12-26: \n -  Replaced LTspice built in 2ndOrderLPF with discrete circuit to improve convergence.\n -  Removed output MUX and replaced it with BV.
RECTANGLE Normal 752 112 -16 -96 2
RECTANGLE Normal 1440 512 -16 192 2

min.asc, the sub-circuit schematic file:
Version 4
SHEET 1 880 680
WIRE 112 64 64 64
WIRE 336 64 256 64
WIRE 112 80 112 64
WIRE 256 80 256 64
WIRE 112 176 112 160
WIRE 256 176 256 160
WIRE 112 224 64 224
WIRE 112 240 112 224
WIRE 112 336 112 320
FLAG 64 64 in1
IOPIN 64 64 In
FLAG 64 224 in2
IOPIN 64 224 In
FLAG 256 176 0
FLAG 336 64 out
IOPIN 336 64 Out
FLAG 112 176 0
FLAG 112 336 0
SYMBOL bv 256 64 R0
SYMATTR InstName B1
SYMATTR Value V=IF(V(in1)<V(in2),V(in1),V(in2))
SYMBOL res 96 64 R0
SYMATTR InstName R1
SYMATTR Value 1Meg
SYMBOL res 96 224 R0
SYMATTR InstName R2
SYMATTR Value 1Meg
TEXT 8 -32 Left 4 ;Minimum Input Select

type2_gm.asc, the sub-circuit schematic file:
Version 4.1
SHEET 1 1136 680
WIRE 432 -144 432 -160
WIRE 544 -144 544 -160
WIRE 432 -48 432 -64
WIRE 544 -48 544 -64
WIRE -128 144 -128 112
WIRE 416 144 416 96
WIRE -336 176 -368 176
WIRE -336 256 -368 256
WIRE -128 272 -128 224
WIRE -128 272 -240 272
WIRE 0 272 -128 272
WIRE 416 272 416 208
WIRE 416 272 0 272
WIRE 640 272 416 272
WIRE -128 304 -128 272
WIRE -240 336 -240 272
WIRE 0 336 0 272
WIRE 416 352 416 272
WIRE -128 416 -128 384
WIRE 416 448 416 416
WIRE -240 496 -240 416
WIRE -128 496 -128 480
WIRE 0 496 0 400
FLAG 640 272 ve
IOPIN 640 272 Out
FLAG -128 496 0
FLAG -240 496 0
FLAG 0 496 0
FLAG -128 112 0
FLAG 544 -48 0
FLAG 432 -48 0
FLAG 432 -160 +V
FLAG 544 -160 -V
FLAG 416 448 -V
FLAG 416 96 +V
FLAG -368 176 fb
IOPIN -368 176 In
FLAG -368 256 ref
IOPIN -368 256 In
SYMBOL bi -128 144 R0
SYMATTR InstName B1
SYMATTR Value I=(limit(V(ref)-V(fb),{-Ilim},{Ilim}))
SYMBOL res -144 288 R0
SYMATTR InstName R1
SYMATTR Value {Rz1}
SYMBOL cap -144 416 R0
SYMATTR InstName C1
SYMATTR Value {Cz1}
SYMBOL res -256 320 R0
SYMATTR InstName R2
SYMATTR Value {avol}
SYMBOL cap -16 336 R0
SYMATTR InstName C2
SYMATTR Value {Co1}
SYMBOL diode 432 416 R180
WINDOW 0 24 64 Left 2
WINDOW 3 24 0 Left 2
SYMATTR InstName D1
SYMATTR Value myD
SYMBOL voltage 432 -160 R0
SYMATTR InstName V1
SYMATTR Value {vh}
SYMBOL voltage 544 -160 R0
WINDOW 123 0 0 Left 0
WINDOW 39 24 44 Left 2
SYMATTR InstName V2
SYMATTR Value {vl}
SYMBOL diode 432 208 R180
WINDOW 0 24 64 Left 2
WINDOW 3 24 0 Left 2
SYMATTR InstName D2
SYMATTR Value myD
TEXT -336 -224 Left 2 !.param g=1\n.param fz1=1k\n.param fp1=20k\n.param vh=5\n.param vl=0\n.param avol=100k
TEXT -352 -288 Left 4 ;Type 2 Compensator, Gm amp base
TEXT -104 -224 Left 2 ;target gain at fz1\nzero frequency(Hz)\npole frequency(Hz)\nmax ouput voltage(V)\nmin output voltage(V)\nopen loop gain
TEXT 808 -328 Left 2 ;2025-08-31
TEXT -56 24 Left 2 !.param Rz1={(g*avol)/(avol-g)}\n.param Cz1={1/(2*PI*fz1*Rz1)}\n.param Co1={1/(2*PI*fp1*Rz1)}
TEXT 488 312 Left 2 !.ic V(ve)=0
TEXT 480 440 Left 2 !.MODEL myD D(RON=1u ROFF=1G Vfwd=10n)
TEXT -88 184 Left 2 !.param Ilim=1000
TEXT 672 -184 Left 2 ;<Revision History>\n2025-08-31: Initial version
TEXT -416 144 Left 2 ;feedback
TEXT -416 216 Left 2 ;reference
TEXT 384 -288 Left 1 ;* TYPE2_gm is a Gm-amp based version of TYPE2.\n* Unlike the op-amp based TYPE2, it offers high input impedance at ref/fb\n* and is better suited for dynamic reference applications (e.g. soft-start,\n* motor speed control). Both models are kept for flexibility.
RECTANGLE Normal 992 -208 368 -304 2

The netlist it stands for:
* BUCK_CCCV.asc
V1 in 0 {5*cell_cnt}
L1 sw N002 10µ Rser=1m
C1 out 0 22µ Rser=1m
X§X2 pwm N001 sw iGD  ; pins in g s
X§X4 out IL N002 IMON rsns=10u  ; pins n out p
X§X6 N004 N005 vco
X§X7 N005 s posedge params: TD=10n
X§X8 N004 CONST K=1Meg  ; pins K
X§X9 vc N007 r cmp params: hys=0
X§X11 r s pwm NC_01 srff params: prio=0
X§X12 pwm slope slope params: Se={((5-3.5)*cell_cnt/10u)*0.1}
X§X14 N006 CONST K={4.2*cell_cnt}  ; pins K
X§X5 IL slope N007 sum
X§X10 in N001 sw iNMOS params: esl=1f rsnb=1k csnb=10p ron=10m  ; pins D G S
X§X16 0 N003 soc voc battery_ecm params: Ah={cell_Ah} s={cell_cnt} soc_init=0.8 type=0 acc=36000
X§X18 N008 CONST K={cell_Ah}  ; pins K
X§X19 N003 Ichg out IMON rsns=10u  ; pins n out p
X§X20 vc_v vc_i vc min
X§X1 0 sw iD params: von=1n ron=10m esl=1f rsnb=1k csnb=10p  ; pins AN CA
X§X3 out out_f lpf params: f=500k n=1 q=0.5
X§X15 Ichg Ichg_f lpf params: f=500k n=1 q=0.5
X§X21 vc_v vc iD params: von=1n ron=10m esl=1f rsnb=1k csnb=10p  ; pins AN CA
X§X22 vc_i vc iD params: von=1n ron=10m esl=1f rsnb=1k csnb=10p  ; pins AN CA
X§X23 out_f N006 vc_v type2_gm params: avol=100k g=6 fz1=5k fp1=200k vh={1.5*cell_Ah} vl=0
X§X24 Ichg_f N008 vc_i type2_gm params: avol=100k g=1 fz1=1k fp1=20k vh={1.5*cell_Ah} vl=0

* block symbol definitions
.subckt vco freq clk
C1 a 0 1
R1 b 0 1k
V2 N001 0 1
B2 a 0 I=IF(V(b),V(freq),0)
B1 N001 a I=IF(V(b),0,V(freq))
A1 b 0 0 0 0 0 clk 0 BUF
.machine
.state LO 0
.state HI 1
.rule LO HI V(a)>0.75
.rule HI LO V(a)<0.25
.output (b) state
.endmachine
.ic V(a)=0.25
* Voltage Controlled Oscillator
* frequency(Hz)
* clock
* duty 50%
* 2025-02-15
* <Revision History>
* 2024-12-29: Initial version
* 2025-02-15: Removed 1Mohm pull down resistor at freq pin to avoid large sink current.
* removed
.ends vco

.subckt posedge in out
A2 0 in 0 N001 0 0 out 0 AND
A1 in 0 0 0 0 N001 0 0 BUF TD={td}
.param td=10n
* Positive Edge Detector
* binary
* binary
* td
* pulse width
* 2024-12-29
.ends posedge

.subckt cmp inn inp out
R1 a 0 1k
A1 a 0 0 0 0 0 out 0 BUF
.machine
.state LO 0
.state HI 1
.rule LO HI V(inp)>(V(inn)+{hys})
.rule HI LO V(inp)<(V(inn)-{hys})
.output (a) state
.endmachine
.param hys=0
* Comparator
* hysteresis voltage
* 2024-12-29
.ends cmp

.subckt srff R S Q xQ
A1 R 0 0 0 0 N001 0 0 BUF
A2 0 S 0 N001 0 0 Sa 0 AND
A3 Qa 0 0 0 0 xQ 0 0 BUF
A4 Qa 0 0 0 0 0 Q 0 BUF
R1 Qa 0 1k
B1 Reff 0 V=IF({prio}==0,V(R),V(R_))
A5 S 0 0 0 0 N002 0 0 BUF
A6 0 N002 0 R 0 0 R_ 0 AND
.machine
.state LO 0
.state HI1 1
.state HI2 1
.rule LO HI1 V(Sa)>0.5
.rule HI1 HI2 V(Sa)<0.5
.rule HI2 LO V(Reff)>0.5
.output (Qa) state
.endmachine
* SR Flip-Flop
* binary
* binary
* binary
* binary
* 2025-12-29
.param prio=0
* 0: priority on R (default), 1: priority on S
* <Revision History>
* 2024-12-29: Initial version
* 2025-12-29: Added parameter "prio" to specify priority between R and S. No impact on default behaviour.
.ends srff

.subckt slope in out
I1 0 a {ibias}
C3 a 0 {cacc}
B1 out 0 V=IF(V(in)>0.5, se*(V(a)-V(b)), 0)
R1 o 0 1k
B2 b 0 V=V(o)
B3 N001 0 V=IF(V(in)>0.5,1, 0)
R2 N001 0 1k
.param se=1
* Slope
* binary
* dv/dt of the slope(V/sec)
* in
* out
* dv/dt=se
* 2026-03-18
* <Revision History>
* 2024-12-29: Initial Versoin
* 2025-02-23: Made following edit to remove negative spike at slope reset and improve simulation time.
*                     - scale of I1 & C2 by 1/1000, and reduced resistance of diode Ron and buffer Rout
*                     - changed C1 snubber parameter,
*                     - added D2 to clamp negative voltage at node a
*                     - added new parameter vsat to be able to specify saturating voltage
* 2025-04-12: Bug fix
*                     - Fixed a bug where the model would not work when vsat was set to a high voltage
*                     - Changed default vsat to 1000V (originally 1V).
* 2025-05-31: Solved convergence issue at high "se"
*                     - Replaced current source with state machine.
* 2026-01-02: Changed to .machine base for higher accuracy and convergence.
*                     - removed .param vsat
* 2026-03-18: Updated .machine statement syntax to support older version of the LTspice.
* .param vsat=1000 (removed)
.param cacc=1u
.param ibias=1u
.ic V(a)=0
.machine
.state LO 0
.state HI 1
.rule LO HI V(in)>.5
.rule HI LO V(in)<.5
.output (o) IF((state==1),V(b), V(a))
.endmachine
* dummy circuit to ensure stiff falling edge
.ends slope

.subckt sum in1 in2 out
B1 OUT 0 V=V(IN1)+V(IN2)
* SUM
* 2024-12-29
.ends sum

.subckt battery_ecm neg pos soc voc
C1 a 0 {Cnom} Rpar=10000Gig
B1 N003 a I=I(R1)*acc
V1 N003 0 1
B2 voc neg V = s * Voc(V(soc))
R1 N002 voc {resr}
R2 pos N002 {rpar}
C2 pos N002 {cpar} Rpar={1/(cpar*1e-12)}
X§X1 a soc LIMIT max=1 min=0  ; pins in out
X§X2 a N003 iD params: von=1n ron=1n esl=1f rsnb=1k csnb=10p  ; pins AN CA
X§X3 0 a iD params: von=1n ron=1n esl=1f rsnb=1k csnb=10p  ; pins AN CA
X§X5 N001 ichg lpf params: f={soc_flt} n=1 q=0.5
B3 N001 0 V=I(R1)
C3 pos neg {cstray}
.func Voc_LFP(x) table(x,
+ 0.00, 2.75,
+ 0.005, 2.85,
+ 0.010, 2.95,
+ 0.020, 3.05,
+ 0.030, 3.12,
+ 0.040, 3.17,
+ 0.050, 3.20,
+ 0.060, 3.22,
+ 0.080, 3.235,
+ 0.100, 3.245,
+ 0.120, 3.250,
+ 0.150, 3.255,
+ 0.180, 3.258,
+ 0.200, 3.260,
+ 0.250, 3.263,
+ 0.300, 3.265,
+ 0.350, 3.266,
+ 0.400, 3.267,
+ 0.450, 3.268,
+ 0.500, 3.269,
+ 0.550, 3.270,
+ 0.600, 3.271,
+ 0.650, 3.272,
+ 0.700, 3.274,
+ 0.750, 3.276,
+ 0.800, 3.279,
+ 0.850, 3.283,
+ 0.880, 3.288,
+ 0.900, 3.295,
+ 0.920, 3.305,
+ 0.940, 3.325,
+ 0.950, 3.340,
+ 0.960, 3.360,
+ 0.970, 3.395,
+ 0.980, 3.440,
+ 0.985, 3.470,
+ 0.990, 3.500,
+ 0.995, 3.530,
+ 1.000, 3.560
+)
.param Ah=10
.param s=1
.param acc=3600
.param type=0
.param soc_init=0
* Nominal capacity (Ah)
* # of series cells
* simulation acceleration factor
* cell type 0:NCM(default), 1:LFP
* initial SoC
.param Ah_ref = 1
.param resr_ref=50m
.param cpar_ref=300
.param rpar_ref=100m
.param resr = s * resr_ref * Ah_ref / Ah
.param cpar = cpar_ref * Ah / Ah_ref / s
.param rpar = s * rpar_ref * Ah_ref / Ah
.param Cnom = Ah * 3600
.func Voc(x) { if(type==1, Voc_LFP(x), Voc_NMC(x)) }
.func Voc_NMC(x) table(x,
+ 0.00, 3.00,
+ 0.005, 3.10,
+ 0.010, 3.20,
+ 0.020, 3.30,
+ 0.030, 3.38,
+ 0.040, 3.44,
+ 0.050, 3.48,
+ 0.060, 3.52,
+ 0.080, 3.58,
+ 0.100, 3.62,
+ 0.120, 3.65,
+ 0.150, 3.68,
+ 0.180, 3.71,
+ 0.200, 3.73,
+ 0.230, 3.75,
+ 0.260, 3.77,
+ 0.300, 3.79,
+ 0.340, 3.81,
+ 0.380, 3.83,
+ 0.420, 3.845,
+ 0.460, 3.86,
+ 0.500, 3.875,
+ 0.540, 3.89,
+ 0.580, 3.905,
+ 0.620, 3.92,
+ 0.660, 3.94,
+ 0.700, 3.96,
+ 0.740, 3.985,
+ 0.780, 4.01,
+ 0.820, 4.04,
+ 0.850, 4.065,
+ 0.880, 4.095,
+ 0.900, 4.11,
+ 0.920, 4.13,
+ 0.940, 4.15,
+ 0.960, 4.17,
+ 0.970, 4.18,
+ 0.980, 4.19,
+ 0.990, 4.205,
+ 1.000, 4.20
+)
.ic V(a)={soc_init}
* BATTERY ECM
* 2025.12.26
.param soc_flt=100k
.param cstray = 10n
* *for sim stability
.ends battery_ecm

.subckt lpf in out
R1 a N001 1k
C1 a 0 {Co}
B1 N001 0 V=V(in)
B2 v0 0 V=V(a)
B3 out 0 V=IF({n}==1,V(v0),V(v1))
R2 v1 0 1Gig
C2 v1 0 1
B5 0 v1 I=V(v2)
R3 v2 0 1Gig
C3 v2 0 1
B4 0 v2 I={-(2*pi*f)*(2*pi*f)*V(v1)-(2*pi*f/q)*V(v2)+(2*pi*f)*(2*pi*f)*V(in)}
* 1st/2nd order Low Pass Filter
* 2025-12-26
.param f=100k
.param n=1
.param q=0.5
.param Co=1/({f}*2k*PI)
* cut off frequency
* filter order (1:1st order, other: 2nd order)
* q factor (only for 2nd order)
* 1st Order LPF
* 2nd Order LPF
* <Revision History>
* 2025-03-23: Initial version
* 2025-12-26:
*  -  Replaced LTspice built in 2ndOrderLPF with discrete circuit to improve convergence.
*  -  Removed output MUX and replaced it with BV.
.ends lpf

.subckt min in1 in2 out
B1 out 0 V=IF(V(in1)<V(in2),V(in1),V(in2))
R1 in1 0 1Meg
R2 in2 0 1Meg
* Minimum Input Select
.ends min

.subckt type2_gm fb ref ve
B1 0 ve I=(limit(V(ref)-V(fb),{-Ilim},{Ilim}))
R1 ve N001 {Rz1}
C1 N001 0 {Cz1}
R2 ve 0 {avol}
C2 ve 0 {Co1}
D1 -V ve myD
V1 +V 0 {vh}
V2 -V 0 {vl}
D2 ve +V myD
.param g=1
.param fz1=1k
.param fp1=20k
.param vh=5
.param vl=0
.param avol=100k
* Type 2 Compensator, Gm amp base
* target gain at fz1
* zero frequency(Hz)
* pole frequency(Hz)
* max ouput voltage(V)
* min output voltage(V)
* open loop gain
* 2025-08-31
.param Rz1={(g*avol)/(avol-g)}
.param Cz1={1/(2*PI*fz1*Rz1)}
.param Co1={1/(2*PI*fp1*Rz1)}
.ic V(ve)=0
.MODEL myD D(RON=1u ROFF=1G Vfwd=10n)
.param Ilim=1000
* <Revision History>
* 2025-08-31: Initial version
* feedback
* reference
* * TYPE2_gm is a Gm-amp based version of TYPE2.
* * Unlike the op-amp based TYPE2, it offers high input impedance at ref/fb
* * and is better suited for dynamic reference applications (e.g. soft-start,
* * motor speed control). Both models are kept for flexibility.
.ends type2_gm

.model D D
.lib standard.dio
.tran 25m
* CC-CV Buck Charger
* 2025-12-26
.options solver="norm"
.options method="gear"
* Voltage loop
* Current loop
* Peak Current Mode Control
.param cell_Ah=200
.param cell_cnt=16
* Cell Configuration
.backanno
.end